# Altium schematic sheet H_Bridge.SchDoc
size A4
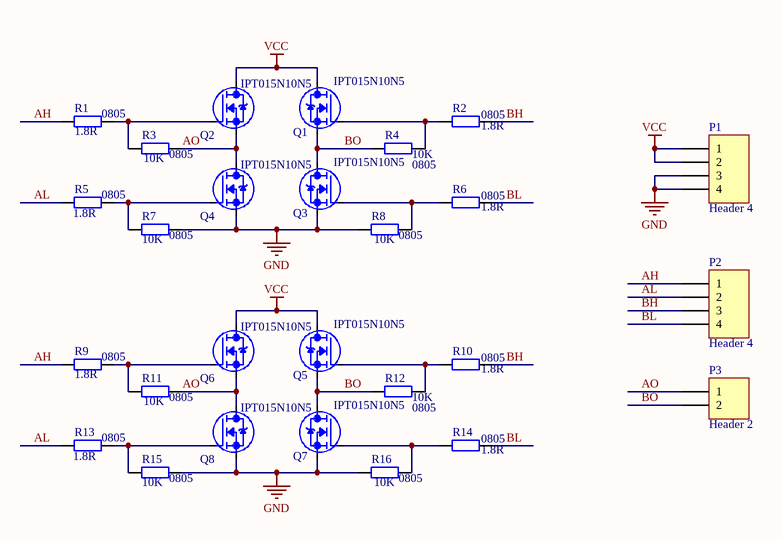
[diagram p0: H_Bridge.SchDoc]

## Parts
P1  Header 4  [HDR2.54-LI-4P]
P2  Header 4  [HDR2.54-LI-4P]
P3  Header 2  [HDR2.54-LI-2P]
Q1  IPT015N10N5  [HSOF-8]
Q2  IPT015N10N5  [HSOF-8]
Q3  IPT015N10N5  [HSOF-8]
Q4  IPT015N10N5  [HSOF-8]
Q5  IPT015N10N5  [HSOF-8]
Q6  IPT015N10N5  [HSOF-8]
Q7  IPT015N10N5  [HSOF-8]
Q8  IPT015N10N5  [HSOF-8]
R1  0805  value 1.8R  [R 0805_L]
R2  0805  value 1.8R  [R 0805_L]
R3  0805  value 10K  [R 0805_L]
R4  0805  value 10K  [R 0805_L]
R5  0805  value 1.8R  [R 0805_L]
R6  0805  value 1.8R  [R 0805_L]
R7  0805  value 10K  [R 0805_L]
R8  0805  value 10K  [R 0805_L]
R9  0805  value 1.8R  [R 0805_L]
R10  0805  value 1.8R  [R 0805_L]
R11  0805  value 10K  [R 0805_L]
R12  0805  value 10K  [R 0805_L]
R13  0805  value 1.8R  [R 0805_L]
R14  0805  value 1.8R  [R 0805_L]
R15  0805  value 10K  [R 0805_L]
R16  0805  value 10K  [R 0805_L]

## Nets
GND: P1.3 P1.4 Q3.2-8(S) Q4.2-8(S) Q7.2-8(S) Q8.2-8(S) R7.2 R8.1 R15.2 R16.1
VCC: P1.1 P1.2 Q1.9(D) Q2.9(D) Q5.9(D) Q6.9(D)
AH: P2.1 R1.1 R9.1
AL: P2.2 R5.1 R13.1
AO: P3.1 Q2.2-8(S) Q4.9(D) Q6.2-8(S) Q8.9(D) R3.2 R11.2
BH: P2.3 R2.2 R10.2
BL: P2.4 R6.2 R14.2
BO: P3.2 Q1.2-8(S) Q3.9(D) Q5.2-8(S) Q7.9(D) R4.1 R12.1
NetQ1_1: Q1.1(G) R2.1 R4.2
NetQ2_1: Q2.1(G) R1.2 R3.1
NetQ3_1: Q3.1(G) R6.1 R8.2
NetQ4_1: Q4.1(G) R5.2 R7.1
NetQ5_1: Q5.1(G) R10.1 R12.2
NetQ6_1: Q6.1(G) R9.2 R11.1
NetQ7_1: Q7.1(G) R14.1 R16.2
NetQ8_1: Q8.1(G) R13.2 R15.1

## Library data of the parts
P1 P2 = Header 4: Header, 4-Pin; LatestRevisionDate: 17-Jul-2002; LatestRevisionNote: Re-released for DXP Platform.; Publisher: Altium Limited
P3 = Header 2: Header, 2-Pin; LatestRevisionDate: 17-Jul-2002; LatestRevisionNote: Re-released for DXP Platform.; Publisher: Altium Limited
Q1-Q8 = NMOS-HSOF-8
R1-R16 = RES2: Resistor; Published: 8-Jun-2000; LatestRevisionDate: 17-Jul-2002; LatestRevisionNote: Re-released for DXP Platform.; PackageReference: AXIAL-0.3; Publisher: Altium Limited; PackageDescription: Axial Device, Thru-Hole; 2 Leads; 0.3 in Pin Spacing